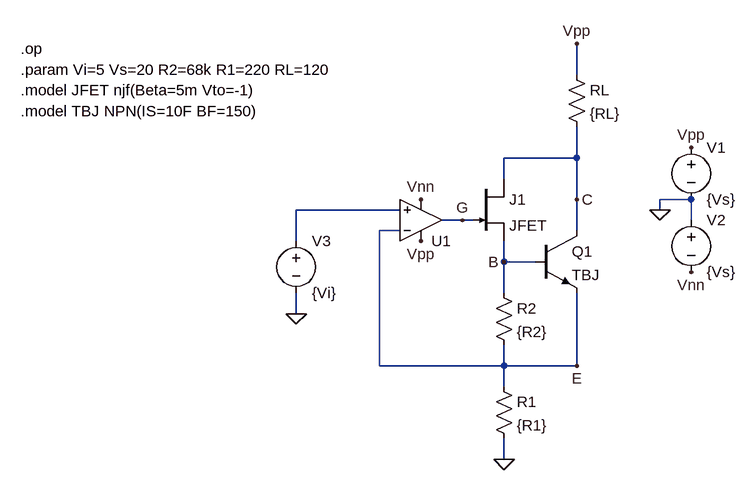
[diagram p0: schematic COMB06op.asc]
COMB06op.asc, the LTspice schematic file:
Version 4
SHEET 1 1720 1076
WIRE 1200 -16 1200 -64
WIRE 1200 112 1200 64
WIRE 1200 112 1088 112
WIRE 1088 144 1088 112
WIRE 1200 176 1200 112
WIRE 1376 176 1328 176
WIRE 928 192 768 192
WIRE 1328 192 1328 176
WIRE 1024 208 992 208
WIRE 1040 208 1024 208
WIRE 1376 208 1376 176
WIRE 928 224 896 224
WIRE 1200 224 1200 176
WIRE 768 240 768 192
WIRE 1088 272 1088 240
WIRE 1136 272 1088 272
WIRE 1088 320 1088 272
WIRE 768 352 768 320
WIRE 896 432 896 224
WIRE 1088 432 1088 400
WIRE 1088 432 896 432
WIRE 1200 432 1200 320
WIRE 1200 432 1088 432
WIRE 1088 464 1088 432
WIRE 1088 576 1088 544
FLAG 1088 576 0
FLAG 1088 272 B
FLAG 1200 176 C
FLAG 1024 208 G
FLAG 1376 96 Vpp
FLAG 1328 192 0
FLAG 1376 288 Vnn
FLAG 960 240 Vpp
FLAG 960 176 Vnn
FLAG 1200 -64 Vpp
FLAG 1200 432 E
FLAG 768 352 0
SYMBOL njf 1040 144 R0
SYMATTR InstName J1
SYMATTR Value JFET
SYMBOL res 1072 304 R0
SYMATTR InstName R2
SYMATTR Value {R2}
SYMBOL res 1184 -32 R0
SYMATTR InstName RL
SYMATTR Value {RL}
SYMBOL npn 1136 224 R0
SYMATTR InstName Q1
SYMATTR Value TBJ
SYMBOL res 1072 448 R0
SYMATTR InstName R1
SYMATTR Value {R1}
SYMBOL OpAmps\\UniversalOpAmp2 960 208 M180
SYMATTR InstName U1
SYMBOL voltage 1376 80 R0
WINDOW 123 0 0 Left 0
WINDOW 39 0 0 Left 0
SYMATTR InstName V1
SYMATTR Value {Vs}
SYMBOL voltage 1376 192 R0
WINDOW 123 0 0 Left 0
WINDOW 39 0 0 Left 0
SYMATTR InstName V2
SYMATTR Value {Vs}
SYMBOL voltage 768 224 R0
WINDOW 123 0 0 Left 0
WINDOW 39 0 0 Left 0
SYMATTR InstName V3
SYMATTR Value {Vi}
TEXT 344 -56 Left 2 !.op
TEXT 344 8 Left 2 !.model JFET njf(Beta=5m Vto=-1)
TEXT 344 -24 Left 2 !.param Vi=5 Vs=20 R2=68k R1=220 RL=120
TEXT 344 40 Left 2 !.model TBJ NPN(IS=10F BF=150)

The netlist it stands for:
* COMB06op.asc
J1 C G B JFET
R2 B E {R2}
RL Vpp C {RL}
Q1 C B E 0 TBJ
R1 E 0 {R1}
XU1 N001 E Vpp Vnn G level2 Avol=1Meg GBW=10Meg Slew=10Meg Ilimit=25m Rail=0 Vos=0 En=0 Enk=0 In=0 Ink=0 Rin=500Meg  ; pins In+ In- V+ V- OUT
V1 Vpp 0 {Vs}
V2 0 Vnn {Vs}
V3 N001 0 {Vi}
.model NPN NPN
.model PNP PNP
.lib standard.bjt
.model NJF NJF
.model PJF PJF
.lib standard.jft
.op
.model JFET njf(Beta=5m Vto=-1)
.param Vi=5 Vs=20 R2=68k R1=220 RL=120
.model TBJ NPN(IS=10F BF=150)
.lib UniversalOpAmp2.lib
.backanno
.end